# Altium schematic sheet 主板原理图.SchDoc
size A4
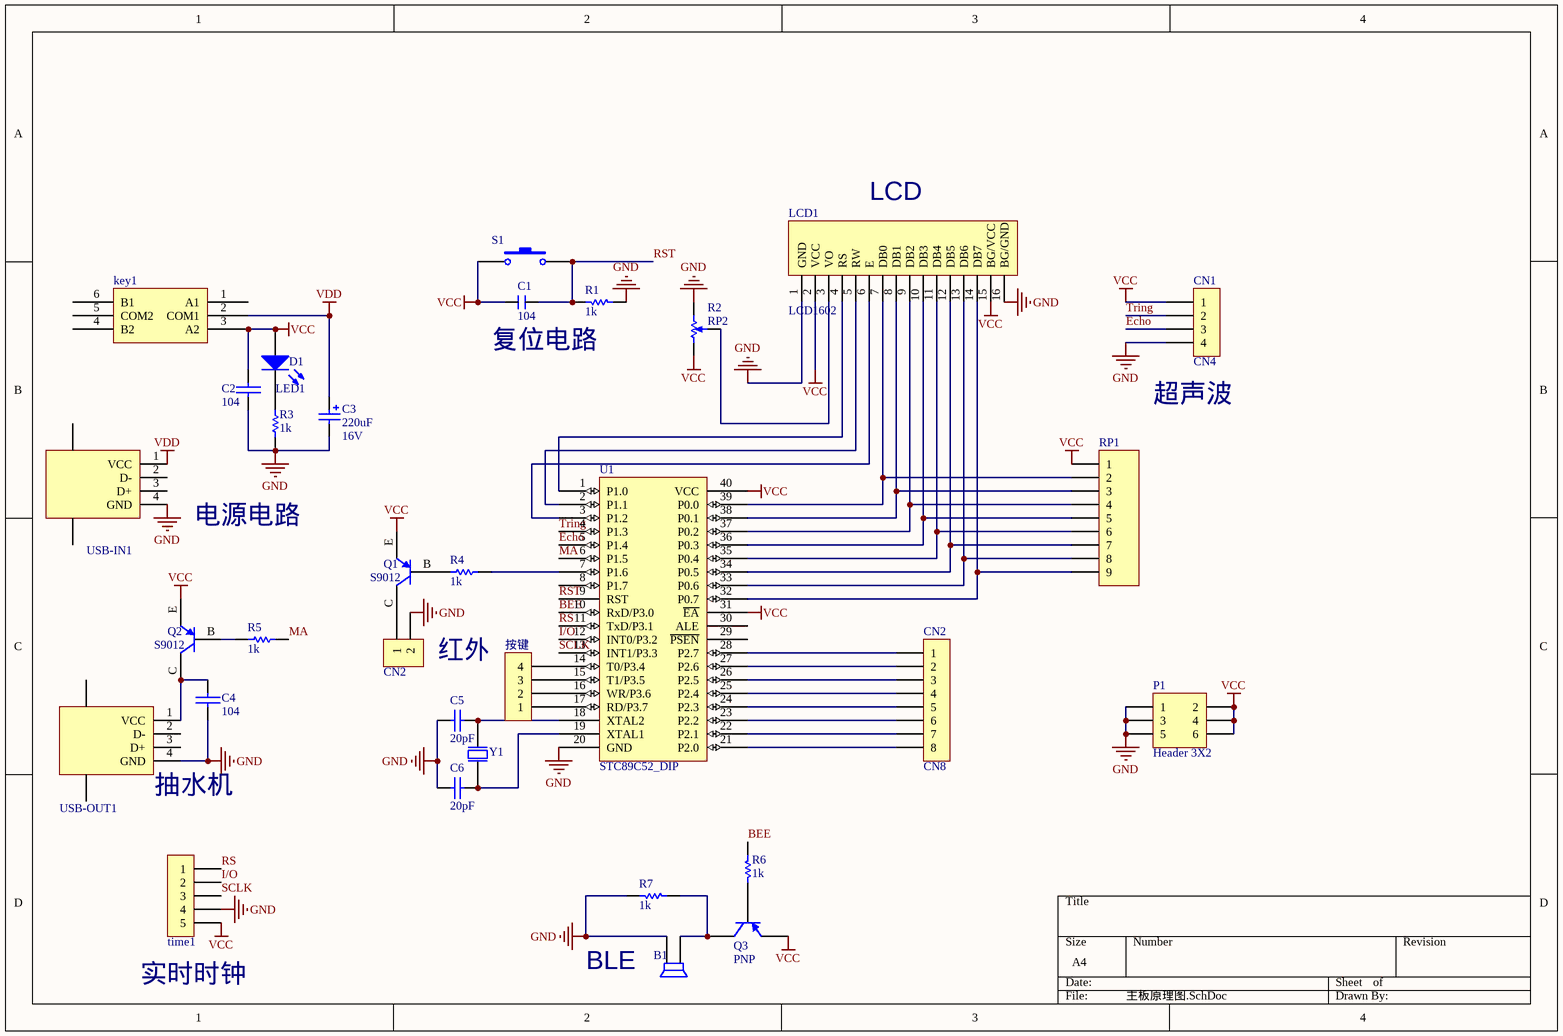
[diagram p0: 主板原理图.SchDoc]

## Parts
B1  BUZZ  [BUZZER]  (value not drawn)
C1  CAP  [RAD-0.1]  (value not drawn)
C2  104  [RAD-0.1]
C3  value 220uF  Voltage: 16V  [CAPPR2.5-6.3X11.5]  (hidden comment: Cap Pol)
C4  104  [RAD-0.1]
C5  value 20pF  [RAD-0.1]  (hidden comment: Cap)
C6  value 20pF  [RAD-0.1]  (hidden comment: Cap)
CN1  CN4  [CN4]
CN2  CN8  [CN8]
CN3  CN2  [CN2]
D1  LED1  [LED1]
key1  SW-KEY  [SW1-key]  (value not drawn)
LCD1  LCD1602  [HDR1X16]
P1  Header 3X2  [HDR2X3]
Q1  S9012  [TO-92A]
Q2  S9012  [TO-92A]
Q3  PNP  [TO-92A]
R1  value 1k  [AXIAL-0.5]  (hidden comment: Res1)
R2  RP2  [POT SMALL]
R3  value 1k  [AXIAL-0.5]  (hidden comment: Res1)
R4  value 1k  [AXIAL-0.5]  (hidden comment: Res1)
R5  value 1k  [AXIAL-0.5]  (hidden comment: Res1)
R6  value 1k  [AXIAL-0.5]  (hidden comment: Res1)
R7  value 1k  [AXIAL-0.5]  (hidden comment: Res1)
RP1  Header 9  [HDR1X9]  (value not drawn)
S1  SW-PB  [SW-TH_4PIN-L6.00-W6.00]  (value not drawn)
time1  CN5  [CN5]  (value not drawn)
U1  STC89C52_DIP  [DIP-40]
USB-IN1  USB-O  [USB-B-TH_4PIN-H-FEMALE-PITCH2.50-TR_U241-041N-1WR85-5]  (value not drawn)
USB-OUT1  USB-O  [USB-O]  (value not drawn)
Y1  XTAL  [XTAL-49/U_N]  (value not drawn)
按键  CN4  [CN4]  (value not drawn)

## Nets
GND: B1.1 C2.1 C3.2 C4.1 C5.1 C6.2 CN1.4 CN3.2 LCD1.1(GND) LCD1.16(BG/GND) P1.1 P1.3 P1.5 R1.1 R2.CW(+) R3.1 R7.2 time1.4 U1.20(GND) USB-IN1.4(GND) USB-OUT1.4(GND)
VCC: C1.1 C2.2 CN1.1 D1.1(A) key1.3(A2) LCD1.2(VCC) LCD1.15(BG/VCC) P1.2 P1.4 P1.6 Q1.E Q2.E Q3.E R2.CCW(-) RP1.1 S1.2 time1.5 U1.31(~{EA}) U1.40(VCC)
VDD: C3.1 key1.2(COM1) USB-IN1.1(VCC)
BEE: R6.1 U1.10(RxD/P3.0)
Echo: CN1.3 U1.5(P1.4)
I/O: time1.2 U1.12(INT0/P3.2)
MA: R5.2 U1.6(P1.5)
RS: time1.1 U1.11(TxD/P3.1)
RST: C1.2 R1.2 S1.1 U1.9(RST)
SCLK: time1.3 U1.13(INT1/P3.3)
Tring: CN1.2 U1.4(P1.3)
NetB1_2: B1.2 Q3.C R7.1
NetC4_2: C4.2 Q2.C USB-OUT1.1(VCC)
NetC5_2: C5.2 U1.18(XTAL2) Y1.2(OSC2)
NetC6_1: C6.1 U1.19(XTAL1) Y1.1(OSC1)
NetCN2_1: CN2.1 U1.28(P2.7)
NetCN2_2: CN2.2 U1.27(P2.6)
NetCN2_3: CN2.3 U1.26(P2.5)
NetCN2_4: CN2.4 U1.25(P2.4)
NetCN2_5: CN2.5 U1.24(P2.3)
NetCN2_6: CN2.6 U1.23(P2.2)
NetCN2_7: CN2.7 U1.22(P2.1)
NetCN2_8: CN2.8 U1.21(P2.0)
NetCN3_1: CN3.1 Q1.C
NetD1_2: D1.2(K) R3.2
NetLCD1_3: LCD1.3(VO) R2.W
NetLCD1_4: LCD1.4(RS) U1.1(P1.0)
NetLCD1_5: LCD1.5(RW) U1.2(P1.1)
NetLCD1_6: LCD1.6(E) U1.3(P1.2)
NetLCD1_7: LCD1.7(DB0) RP1.2 U1.39(P0.0)
NetLCD1_8: LCD1.8(DB1) RP1.3 U1.38(P0.1)
NetLCD1_9: LCD1.9(DB2) RP1.4 U1.37(P0.2)
NetLCD1_10: LCD1.10(DB3) RP1.5 U1.36(P0.3)
NetLCD1_11: LCD1.11(DB4) RP1.6 U1.35(P0.4)
NetLCD1_12: LCD1.12(DB5) RP1.7 U1.34(P0.5)
NetLCD1_13: LCD1.13(DB6) RP1.8 U1.33(P0.6)
NetLCD1_14: LCD1.14(DB7) RP1.9 U1.32(P0.7)
NetQ1_B: Q1.B R4.1
NetQ2_B: Q2.B R5.1
NetQ3_B: Q3.B R6.2
NetR4_2: R4.2 U1.7(P1.6)
NetU1_14: U1.14(T0/P3.4) 按键.4
NetU1_15: U1.15(T1/P3.5) 按键.3
NetU1_16: U1.16(WR/P3.6) 按键.2
NetU1_17: U1.17(RD/P3.7) 按键.1

Not connected (* = marked no-connect by the designer): key1 1(A1) 4(B2) 5(COM2) 6(B1); U1 8(P1.7) 29(~{PSEN}) 30(ALE); USB-IN1 2(D-) 3(D+); USB-OUT1 2(D-) 3(D+)

## Notes on the sheet
- LCD
- (near C1) 复位电路
- (near CN1) 超声波
- 电源电路
- (near CN3) 红外
- (near USB-OUT1) 抽水机
- (near time1) 实时时钟
- BLE
- (in symbol CAP) 104

## Library data of the parts
C1 = CAP: 无极性
C2 C4 = CAP: 电容
C3 = Cap Pol: Polarized Capacitor (Radial); Published: 8-Jun-2000; Revision: July-2002: Re-released for DXP Platform.; Publisher: Altium Limited
C5 C6 = Cap: Capacitor; Published: 8-Jun-2000; LatestRevisionDate: 17-Jul-2002; LatestRevisionNote: Re-released for DXP Platform.; PackageReference: RAD-0.3; Publisher: Altium Limited; PackageDescription: Radial Cap, Thru-Hole; 2 Leads; 0.3 in Pin Spacing
D1 = LED1: 3mm
P1 = Header 3X2: Header, 3-Pin, Dual row; LatestRevisionDate: 17-Jul-2002; LatestRevisionNote: Re-released for DXP Platform.; Publisher: Altium Limited
Q1 Q2 = S9012: PNP 三极管; Published: 8-Jun-2000; LatestRevisionDate: 29-May-2009; LatestRevisionNote: IPC-7351 Footprint Added.; PackageVersion: Aug-1999; PackageReference: SOT-23B; Publisher: Altium Limited; PackageDescription: 3-Pin SOT-23 Package 0.95 mm Pitch, 2.4 mm Lead Span
Q3 = PNP: 8550 9012
R1 R3-R7 = Res1: Resistor; Published: 8-Jun-2000; LatestRevisionDate: 17-Jul-2002; LatestRevisionNote: Re-released for DXP Platform.; PackageReference: AXIAL-0.3; Publisher: Altium Limited; PackageDescription: Axial Device, Thru-Hole; 2 Leads; 0.3 in Pin Spacing
R2 = RPot SM: Square Trimming Potentiometer; pin to pad: CCW>3 CW>2 W>1; Published: 17-Dec-2003; DatasheetVersion: Oct-2003; PackageReference: POT4MM-2; Publisher: Altium Limited; PackageDescription: Square Trimming Potentiometer; ComponentLink1Description: Manufacturer Link; ComponentLink1URL: http://bourns.com/2/search.html
RP1 = Header 9: Header, 9-Pin; LatestRevisionDate: 17-Jul-2002; LatestRevisionNote: Re-released for DXP Platform.; Publisher: Altium Limited
S1 = SW-PB: Switch; Published: 24-Mar-1999; LatestRevisionDate: 17-Jul-2002; LatestRevisionNote: Re-released for DXP Platform.; PackageReference: SPST-2; Publisher: Altium Limited; PackageDescription: Switch; 2 Leads
Y1 = XTAL: Crystal Oscillator; Frequency: 12MHz; Published: 8-Jun-2000; Revision: July-2002: Re-released for DXP Platform.; Publisher: Altium Limited